# EAGLE design Bendy1 (EAGLE 9.6.2)
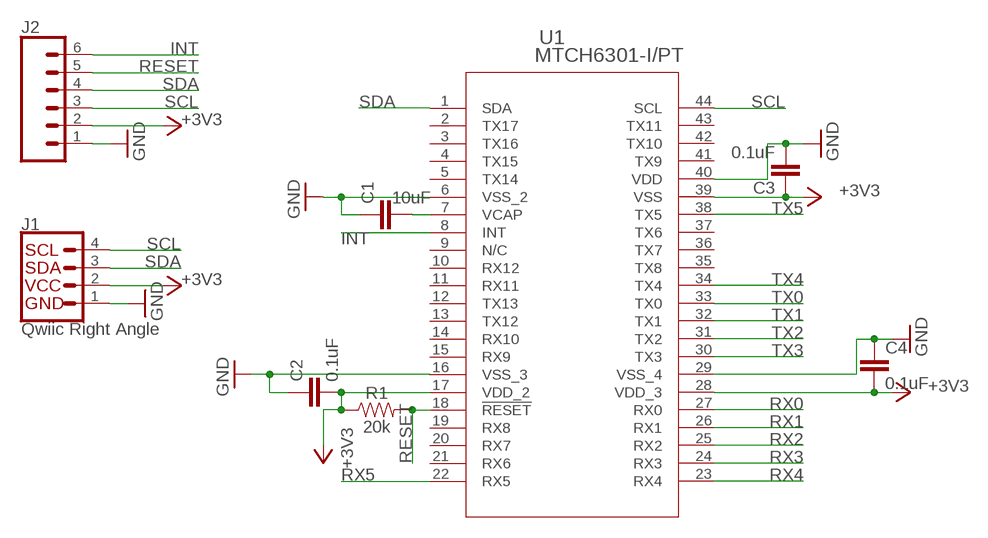
[diagram p0: schematic, sheet 1]

## Parts
C1  10uF  10UF-0603-6.3V-20%  [0603]
C2  0.1uF  0.1UF-0603-25V-(+80/-20%)  [0603]
C3  0.1uF  0.1UF-0603-25V-(+80/-20%)  [0603]
C4  0.1uF  0.1UF-0402-10V-10%-X7R  [0402]
J1  Qwiic Right Angle  I2C_STANDARDQWIIC  [JST04_1MM_RA]
J2  CONN_06NO_SILK_FEMALE_PTH  [1X06_NO_SILK]
R1  20k  20KOHM-0603-1/10W-1%  [0603]
U1  MTCH6301-I/PT  [TQFP44_10X10MC_MCH]

## Nets
+3V3: C2.2 C3.1 C4.2 J1.2 J2.2 R1.1 U1.17(VDD_2) U1.28(VDD_3) U1.39(VSS)
GND: C1.1 C2.1 C3.2 C4.1 J1.1 J2.1 U1.6(VSS_2) U1.16(VSS_3) U1.29(VSS_4) U1.40(VDD)
INT: J2.6 U1.8(INT)
N$2: C1.2 U1.7(VCAP)
RESET: J2.5 R1.2 U1.18(!RESET)
RX0: U1.27(RX0)
RX1: U1.26(RX1)
RX2: U1.25(RX2)
RX3: U1.24(RX3)
RX4: U1.23(RX4)
RX5: U1.22(RX5)
SCL: J1.4 J2.3 U1.44(SCL)
SDA: J1.3 J2.4 U1.1(SDA)
TX0: U1.33(TX0)
TX1: U1.32(TX1)
TX2: U1.31(TX2)
TX3: U1.30(TX3)
TX4: U1.34(TX4)
TX5: U1.38(TX5)
Unconnected: U1.2(TX17) U1.3(TX16) U1.4(TX15) U1.5(TX14) U1.9(N/C) U1.10(RX12) U1.11(RX11) U1.12(TX13) U1.13(TX12) U1.14(RX10) U1.15(RX9) U1.19(RX8) U1.20(RX7) U1.21(RX6) U1.35(TX8) U1.36(TX7) U1.37(TX6) U1.41(TX9) U1.42(TX10) U1.43(TX11)

## Library data of the parts
C1 = SparkFun-Capacitors:10UF: 10.0µF ceramic capacitors A capacitor is a passive two-terminal electrical component used to store electrical energy temporarily in an electric field.; PROD_ID: CAP-11015
C2 C3 = SparkFun-Capacitors:0.1UF: 0.1µF ceramic capacitors A capacitor is a passive two-terminal electrical component used to store electrical energy temporarily in an electric field.; PROD_ID: CAP-00810
C4 = SparkFun-Capacitors:0.1UF: 0.1µF ceramic capacitors A capacitor is a passive two-terminal electrical component used to store electrical energy temporarily in an electric field.; PROD_ID: CAP-15083
J1 = SparkFun-Connectors:I2C_STANDARD: SparkFun I2C Standard Pinout Header SparkFun has standardized on a pinout for all I2C based sensor breakouts. This pinout allows I2C boards to be plugged directly into the headers on Arduino Uno compatible boards, and to be daisy chained easily. Example SparkFun Products: SparkFun Atmospheric Sensor Breakout - BME280 <https://www.sparkfun.com/products/13676> SparkFun Altitude/Pressure Sensor Breakout - MPL3115A2 <https://www.sparkfun.com/products/11084> SparkFun TOF Range Finder Sensor - VL6180 <https://www.sparkfun.com/products/12785>; PROD_ID: CONN-13694
J2 = SparkFun-Connectors:CONN_06: Multi connection point. Often used as Generic Header-pin footprint for 0.1 inch spaced/style header connections On any of the 0.1 inch spaced packages, you can populate with these: Break Away Headers - Straight <https://www.sparkfun.com/products/116> (PRT-00116) Break Away Male Headers - Right Angle <https://www.sparkfun.com/products/553> (PRT-00553) Female Headers <https://www.sparkfun.com/products/115> (PRT-00115) Break Away Headers - Machine Pin <https://www.sparkfun.com/products/117> (PRT-00117) Break Away Female Headers - Swiss Machine Pin <https://www.sparkfun.com/products/743> (PRT-00743) Arduino Stackable Header - 6 Pin <https://www.sparkfun.com/products/9280> (PRT-09280) Screw Terminals 2.54mm Pitch (6-Pin) <https://www.sparkfun.com/products/16499> (PRT-16499) For SCREWTERMINALS and SPRING TERMINALS visit here: Screw Terimnals on SparkFun.com <https://www.sparkfun.com/search/results?term=Screw+Terminals> (5mm/3.5mm/2.54mm spacing) This device is also useful as a general connection point to wire up your design to another part of your project. Our various solder wires solder well into these plated through hole pads. Hook-Up Wire - Assortment (Stranded, 22 AWG) <https://www.sparkfun.com/products/11375> (PRT-11375) Hook-Up Wire - Assortment (Solid Core, 22 AWG) <https://www.sparkfun.com/products/11367> (PRT-11367) View the entire wire category on our website here <https://www.sparkfun.com/categories/141>; PROD_ID: CONN-08437
R1 = SparkFun-Resistors:20KOHM: 20kΩ resistor A resistor is a passive two-terminal electrical component that implements electrical resistance as a circuit element. Resistors act to reduce current flow, and, at the same time, act to lower voltage levels within circuits. - Wikipedia; PROD_ID: RES-09383
U1 = MTCH6301:MTCH6301-I/PT; COPYRIGHT: Copyright (C) 2024 Ultra Librarian. All rights reserved.; MANUFACTURER_PART_NUMBER: MTCH6301-I/PT; MFR_NAME: Microchip

## Board
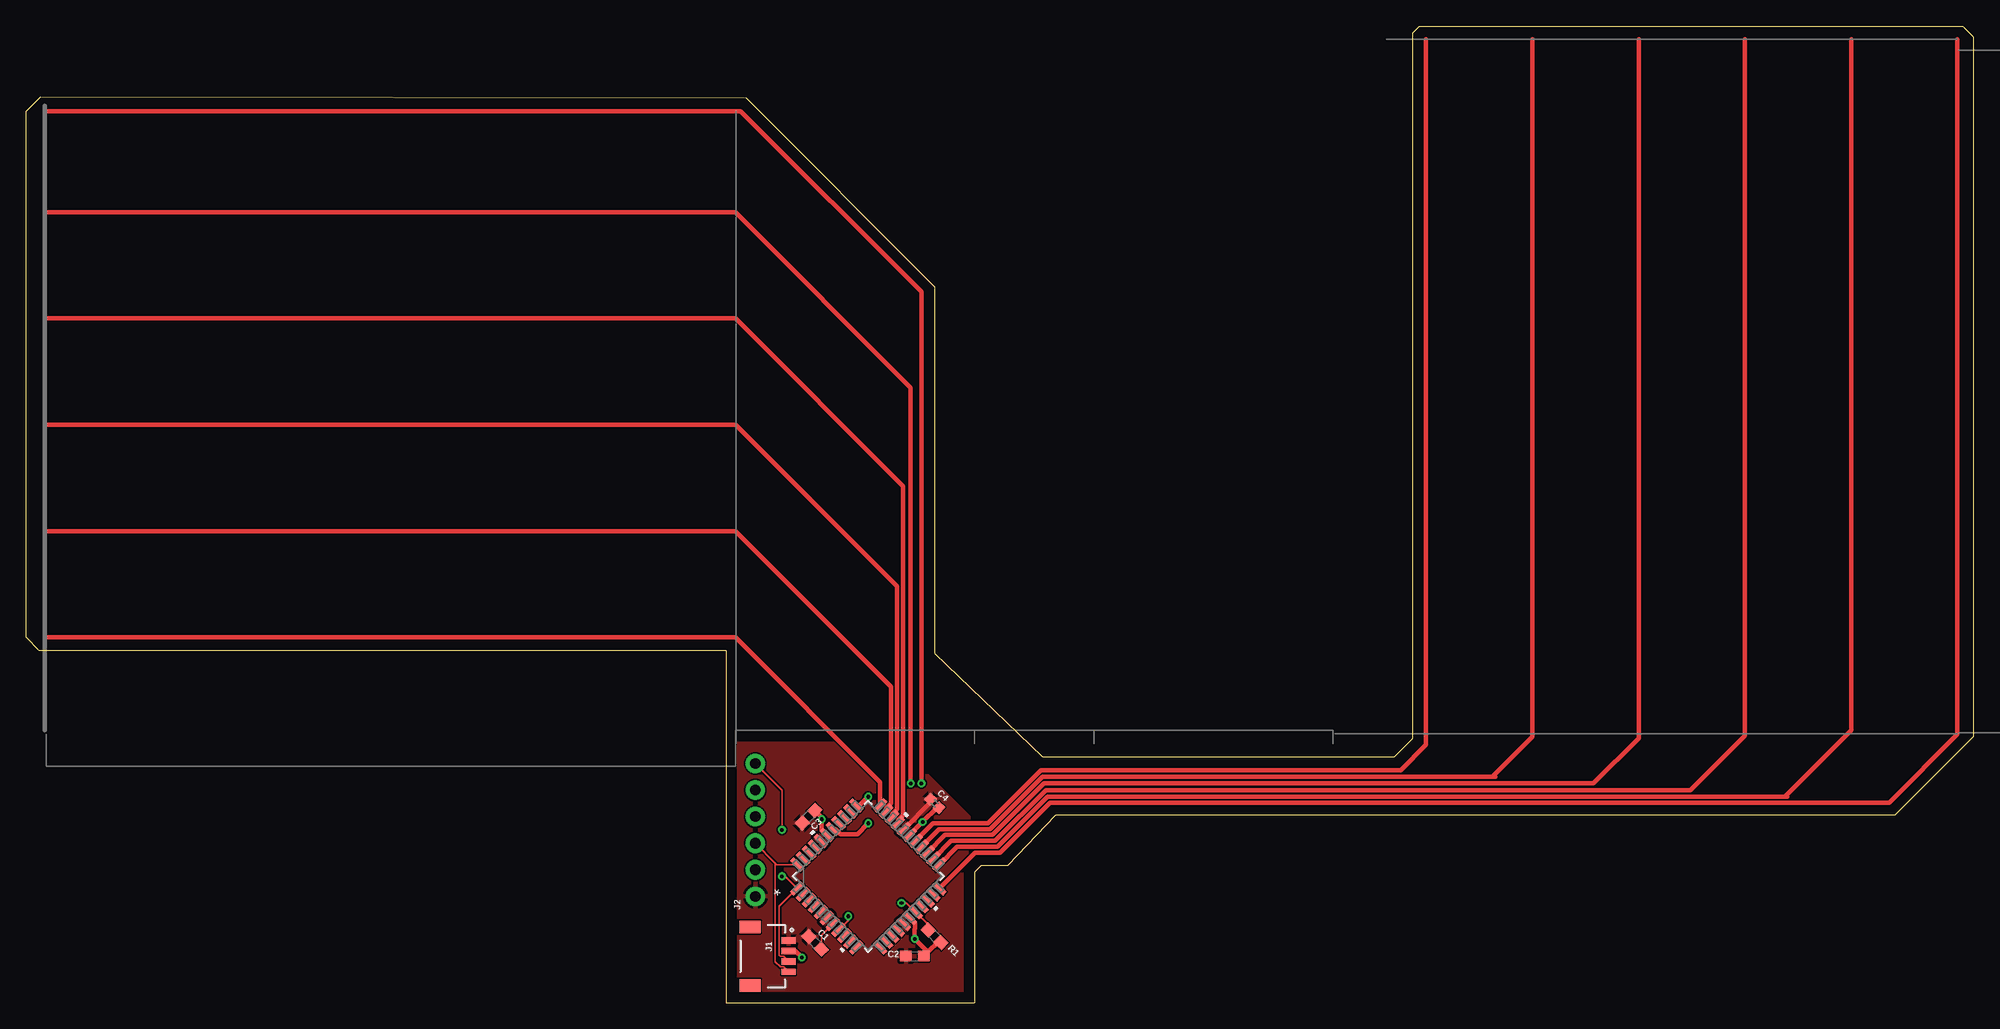
[diagram p1: board, top side]
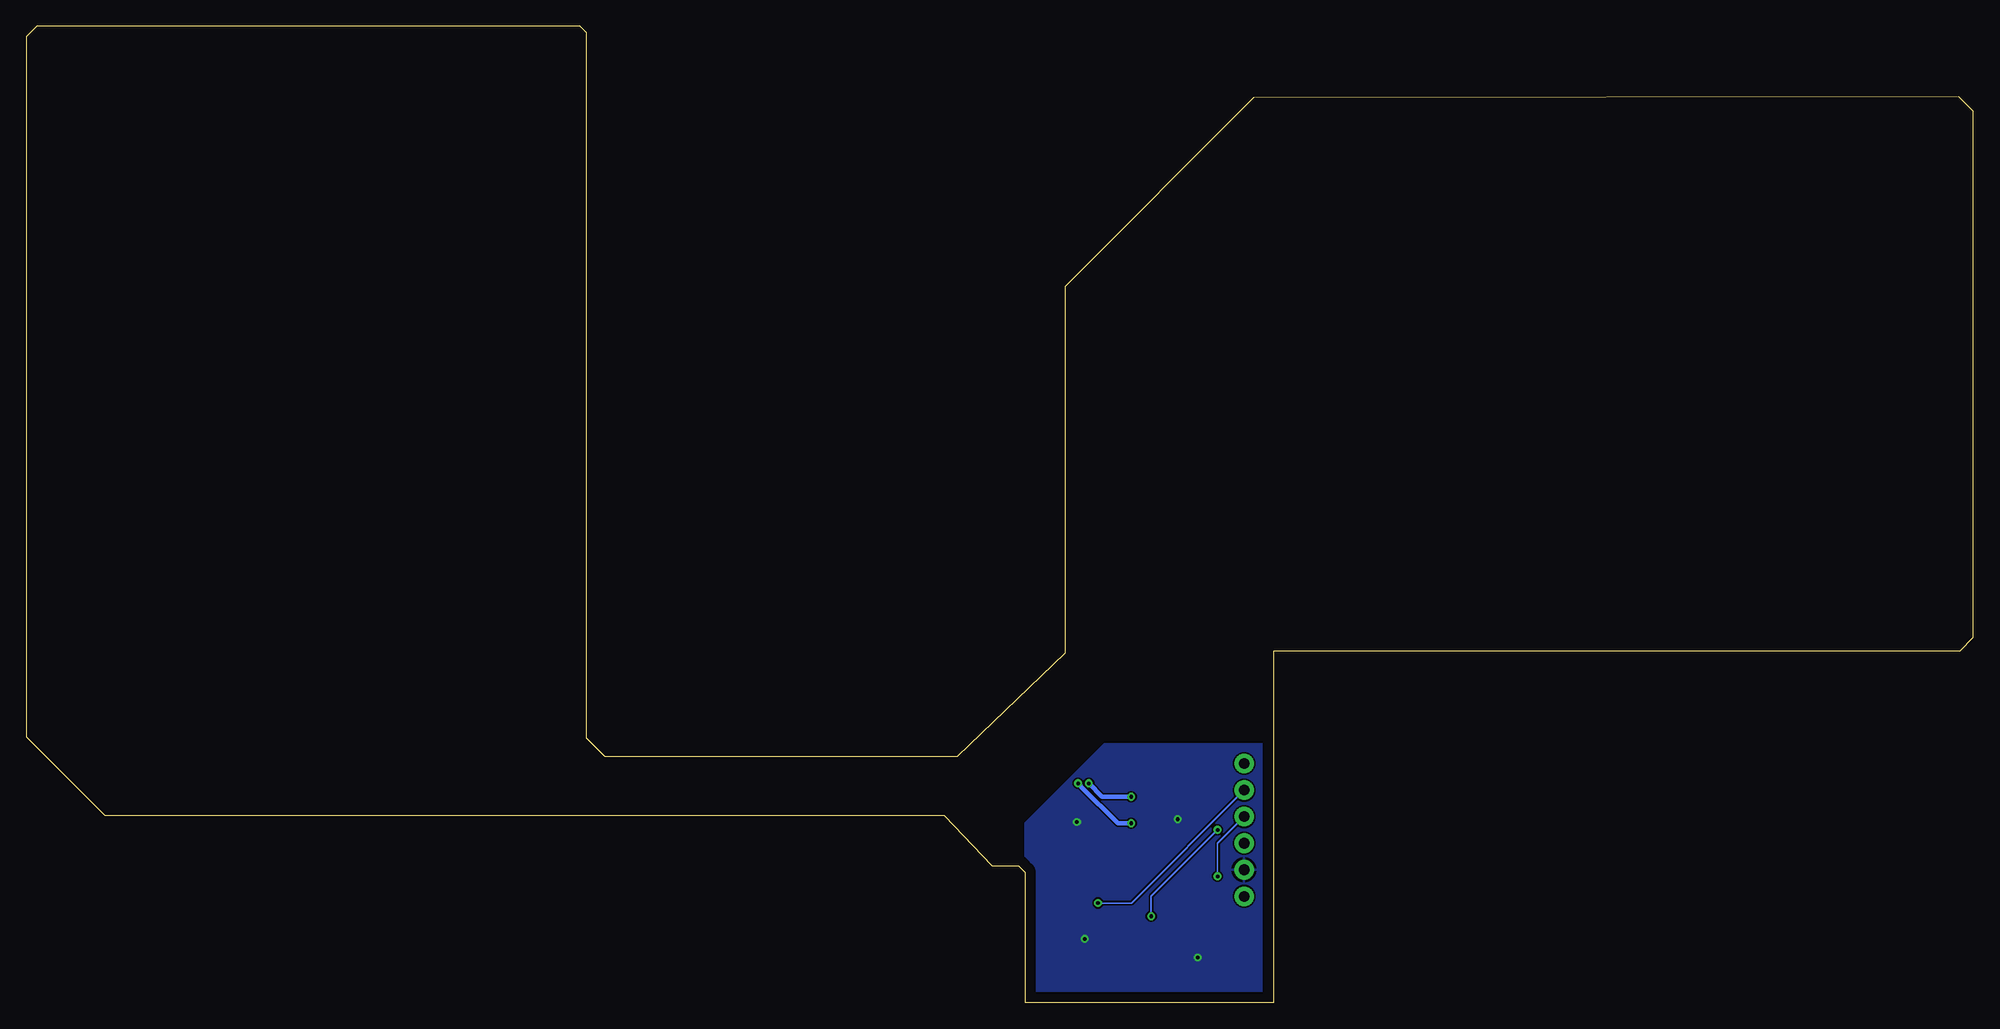
[diagram p2: board, bottom side, seen from below]

Size 186.18 x 93.34 mm. Coordinates in mm from the lower left corner, seen from the top.
Outline: 66.93,33.66 66.93,0 90.68,0 90.68,12.45 91.31,13.08 93.85,13.08 98.42,17.91 178.69,17.91 186.18,25.4 186.18,92.33 185.17,93.34 133.22,93.34 132.59,92.71 132.59,25.27 130.81,23.5 97.16,23.5 86.87,33.4 86.87,68.45 68.83,86.49 1.4,86.61 0,85.22 0,34.92 1.27,33.66 66.93,33.66
Copper layers (1*16): Top 0.018mm / dielectric 0.1mm / Bottom 0.018mm
Design rules "default *": minimum track width 6mil, minimum drill 0.35mm, track to track 6mil, track to pad 6mil, pad to pad 6mil, via to via 6mil, smd to smd 6mil, copper to edge 40mil, drill to drill 6mil, minimum pad ring 10mil, minimum via ring 8mil, stop-mask expansion 4mil, vias tented up to drill 0mil, thermal gap 10mil

### Footprints (pad centres in the part's own frame; a part is rotated, then mirrored left to right if it is on the bottom)
0603 = smd 1.1 x 1: 1 -0.85,0; 2 0.85,0
0402 = smd 0.85 x 0.9: 1 -0.58,0; 2 0.58,0
JST04_1MM_RA = smd 0.6 x 1.35: 1 -1.5,0; 2 -0.5,0; 3 0.5,0; 4 1.5,0 | smd 1.2 x 2: NC1 2.8,-3.675; NC2 -2.8,-3.675
1X06_NO_SILK = drill 1.016 pad 1.88: 1 0,0; 2 2.54,0; 3 5.08,0; 4 7.62,0; 5 10.16,0; 6 12.7,0
TQFP44_10X10MC_MCH = smd 1.473 x 0.508: 1 -5.613,4; 2 -5.613,3.2; 3 -5.613,2.4; 4 -5.613,1.6; 5 -5.613,0.8; 6 -5.613,0; 7 -5.613,-0.8; 8 -5.613,-1.6; 9 -5.613,-2.4; 10 -5.613,-3.2; 11 -5.613,-4; 23 5.613,-4; 24 5.613,-3.2; 25 5.613,-2.4; 26 5.613,-1.6; 27 5.613,-0.8; 28 5.613,0; 29 5.613,0.8; 30 5.613,1.6; 31 5.613,2.4; 32 5.613,3.2; 33 5.613,4 | smd 0.508 x 1.473: 12 -4,-5.613; 13 -3.2,-5.613; 14 -2.4,-5.613; 15 -1.6,-5.613; 16 -0.8,-5.613; 17 0,-5.613; 18 0.8,-5.613; 19 1.6,-5.613; 20 2.4,-5.613; 21 3.2,-5.613; 22 4,-5.613; 34 4,5.613; 35 3.2,5.613; 36 2.4,5.613; 37 1.6,5.613; 38 0.8,5.613; 39 0,5.613; 40 -0.8,5.613; 41 -1.6,5.613; 42 -2.4,5.613; 43 -3.2,5.613; 44 -4,5.613

### Placement (x,y rotation side)
C1  75.44,5.71 315 top
C2  84.96,4.45 0 top
C3  74.8,17.78 225 top
C4  86.87,19.05 315 top
J1  72.9,4.45 270 top
J2  69.72,10.16 90 top
R1  86.87,6.35 135 top
U1  80.52,12.06 45 top

### Tracks (layer width: path | path; a pad name or v marks a point on that pad's centre or on a via)
+3V3  (via drill 0.35)
  Top 0.406: J1.2 73.54,4.94 v74.17,4.32 | U1.28 v85.72,17.27 87.09,18.64 C4.2 | C2.2 86.34,4.97 | 86.34,4.97 87.12,5.75 R1.1 | U1.17 84.98,7.6 84.98,7.04 84.96,7.03 v84.96,6.1 86.09,4.97 86.34,4.97 | C3.1 76.07,17.71 v76.07,17.53 76.07,17.1 76.06,17.09 76.06,16.53 U1.39
  pour Bottom: 66.93,0 66.93,24.77 83.06,24.77 90.68,17.15 90.68,0
GND
  Top 0.406: U1.29 86.46,19.14 C4.1
  pour Top: 66.93,0 66.93,24.77 83.06,24.77 90.68,17.15 90.68,0
INT  (via drill 0.35)
  Top 0.152: U1.8 78.61,7.9 v78.61,8.26 | J2.6 72.26,20.32 v72.26,16.51
  Bottom 0.152: v72.26,16.51 78.61,10.16 v78.61,8.26
N$2
  Top 0.152: C1.2 76.04,6.46 U1.7
RESET  (via drill 0.35)
  Top 0.152: R1.2 86.27,7.45 U1.18 84.19,9.53 v83.69,9.53
  Bottom 0.152: J2.5 80.52,9.53 v83.69,9.53
RX0
  Top 0.406: U1.27 86.73,17.15 91.95,17.15 97.03,22.23 131.44,22.23 133.86,24.64 133.86,92.08
RX1
  Top 0.406: U1.26 87.3,16.59 92.18,16.59 97.18,21.59 140.21,21.59 | 140.21,21.59 140.46,21.59 | 140.21,21.59 144.02,25.4 144.02,92.08
RX2
  Top 0.406: U1.25 87.88,16.03 92.41,16.03 97.34,20.96 149.86,20.96 154.18,25.27 154.18,92.08
RX3
  Top 0.406: U1.24 88.45,15.47 92.64,15.47 97.49,20.32 159.13,20.32 164.34,25.53 164.34,92.08
RX4
  Top 0.406: U1.23 89.02,14.91 92.87,14.91 97.65,19.69 168.15,19.69 | 168.15,19.69 168.4,19.69 | 168.15,19.69 174.5,26.04 174.5,92.08
RX5
  Top 0.406: U1.22 90.74,14.35 93.1,14.35 97.88,19.13 178.13,19.13 184.66,25.65 184.66,92.08
SCL
  Top 0.152: J2.3 71.63,13.33 | 71.63,13.33 71.76,13.21 U1.44 | J1.4 72.43,3.42 72.13,3.42 71.63,3.92 71.63,13.33
SDA  (via drill 0.35)
  Top 0.152: v72.26,12.06 72.58,12.06 U1.1 71.99,9.2 71.99,4.55 72.13,4.42 72.43,4.42 J1.3
  Bottom 0.152: J2.4 72.26,15.24 v72.26,12.06
TX0
  Top 0.406: U1.33 81.66,21.08 67.82,34.92 1.78,34.92
TX1
  Top 0.406: U1.32 82.22,18.57 82.72,19.06 82.72,30.19 67.82,45.09 1.78,45.09
TX2
  Top 0.406: U1.31 82.79,18 83.28,18.49 83.28,39.78 67.82,55.24 1.78,55.24
TX3
  Top 0.406: U1.30 83.36,17.44 83.85,17.93 83.85,49.38 67.82,65.41 1.78,65.41
TX4  (via drill 0.35)
  Top 0.406: U1.34 79.7,18.86 v80.52,19.69 | v84.58,20.96 84.58,58.8 67.82,75.57 1.78,75.57
  Bottom 0.406: v80.52,19.69 83.31,19.69 v84.58,20.96
TX5  (via drill 0.35)
  Top 0.406: U1.38 77.38,16.6 77.87,16.11 79.48,16.11 v80.52,17.15 | v85.6,20.96 85.6,67.95 68.33,85.22 1.78,85.22
  Bottom 0.406: v85.6,20.96 85.31,20.67 85.31,20.65 81.81,17.15 v80.52,17.15